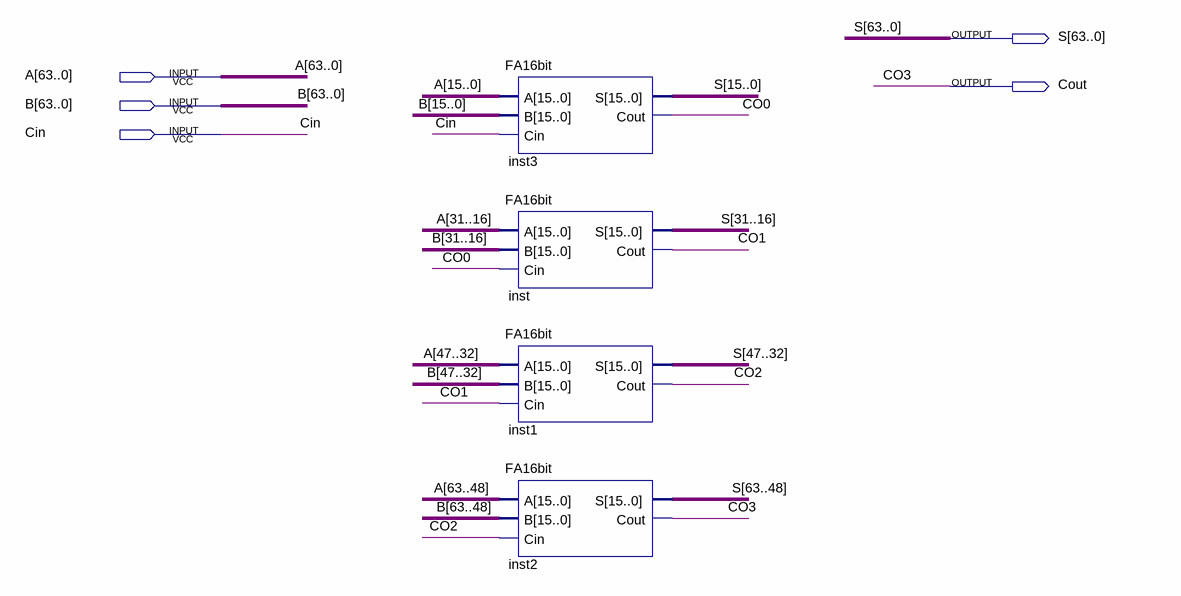
[diagram p0: schematic sheet]
// Quartus schematic FA64Bit.bdf as structural Verilog: 4 symbols, 5 pins
module FA64Bit (
  input  [63:0] A,
  input  [63:0] B,
  input  Cin,
  output [63:0] S,
  output Cout
);

  wire CO0, CO1, CO2;

  FA16bit inst3 (.A(A[15:0]), .B(B[15:0]), .Cin(Cin), .S(S[15:0]), .Cout(CO0));
  FA16bit inst (.A(A[31:16]), .B(B[31:16]), .Cin(CO0), .S(S[31:16]), .Cout(CO1));
  FA16bit inst1 (.A(A[47:32]), .B(B[47:32]), .Cin(CO1), .S(S[47:32]), .Cout(CO2));
  FA16bit inst2 (.A(A[63:48]), .B(B[63:48]), .Cin(CO2), .S(S[63:48]), .Cout(Cout));

  // Other names for the same wires on the sheet: CO3 = Cout
endmodule
